# Altium schematic sheet subADCIn.SchDoc
size A4
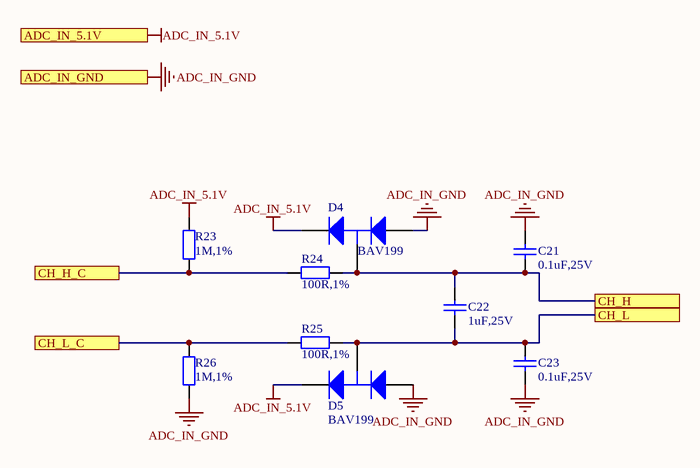
[diagram p0: subADCIn.SchDoc]

## Parts
C21  0.1uF,25V  [C0603]
C22  1uF,25V  [C0603]
C23  0.1uF,25V  [C0603]
D4  BAV199  [SOT-23]
D5  BAV199  [SOT-23]
R23  1M,1%  [R0603]
R24  100R,1%  [R0603]
R25  100R,1%  [R0603]
R26  1M,1%  [R0603]

## Ports
ADC_IN_5.1V, ADC_IN_GND, CH_H, CH_H_C, CH_L, CH_L_C

## Nets
ADC_IN_5.1V: D4.2(K) D5.2(K) R23.2 ; port ADC_IN_5.1V
ADC_IN_GND: C21.1 C23.2 D4.1(A) D5.1(A) R26.2 ; port ADC_IN_GND
CH_H: C21.2 C22.1 D4.3(C) R24.1 ; port CH_H
CH_H_C: R23.1 R24.2 ; port CH_H_C
CH_L: C22.2 C23.1 D5.3(C) R25.1 ; port CH_L
CH_L_C: R25.2 R26.1 ; port CH_L_C

## Library data of the parts
C21-C23 = CAP: Capacitor; Fitted: True
D4 D5 = BAV199: Silicon Low-Leakage Diode Array connected in series; Published: 8-Jun-2000; DatasheetDocument: Oct-1999; PackageDocument: Sep-2001; PackageReference: SOT-23; Publisher: Altium Limited; ComponentLink1Description: Manufacturer Link; ComponentLink1URL: http://www.infineon.com/; ComponentLink2Description: Datasheet; ComponentLink2URL: http://www.infineon.com/upload/Document/cmc_upload/documents/009/441/bav199series_1.pdf
R23-R26 = 电阻: Value: 3.3K, 10%; Type: 贴片电阻